# EAGLE schematic crtBias (EAGLE 7.5.0)
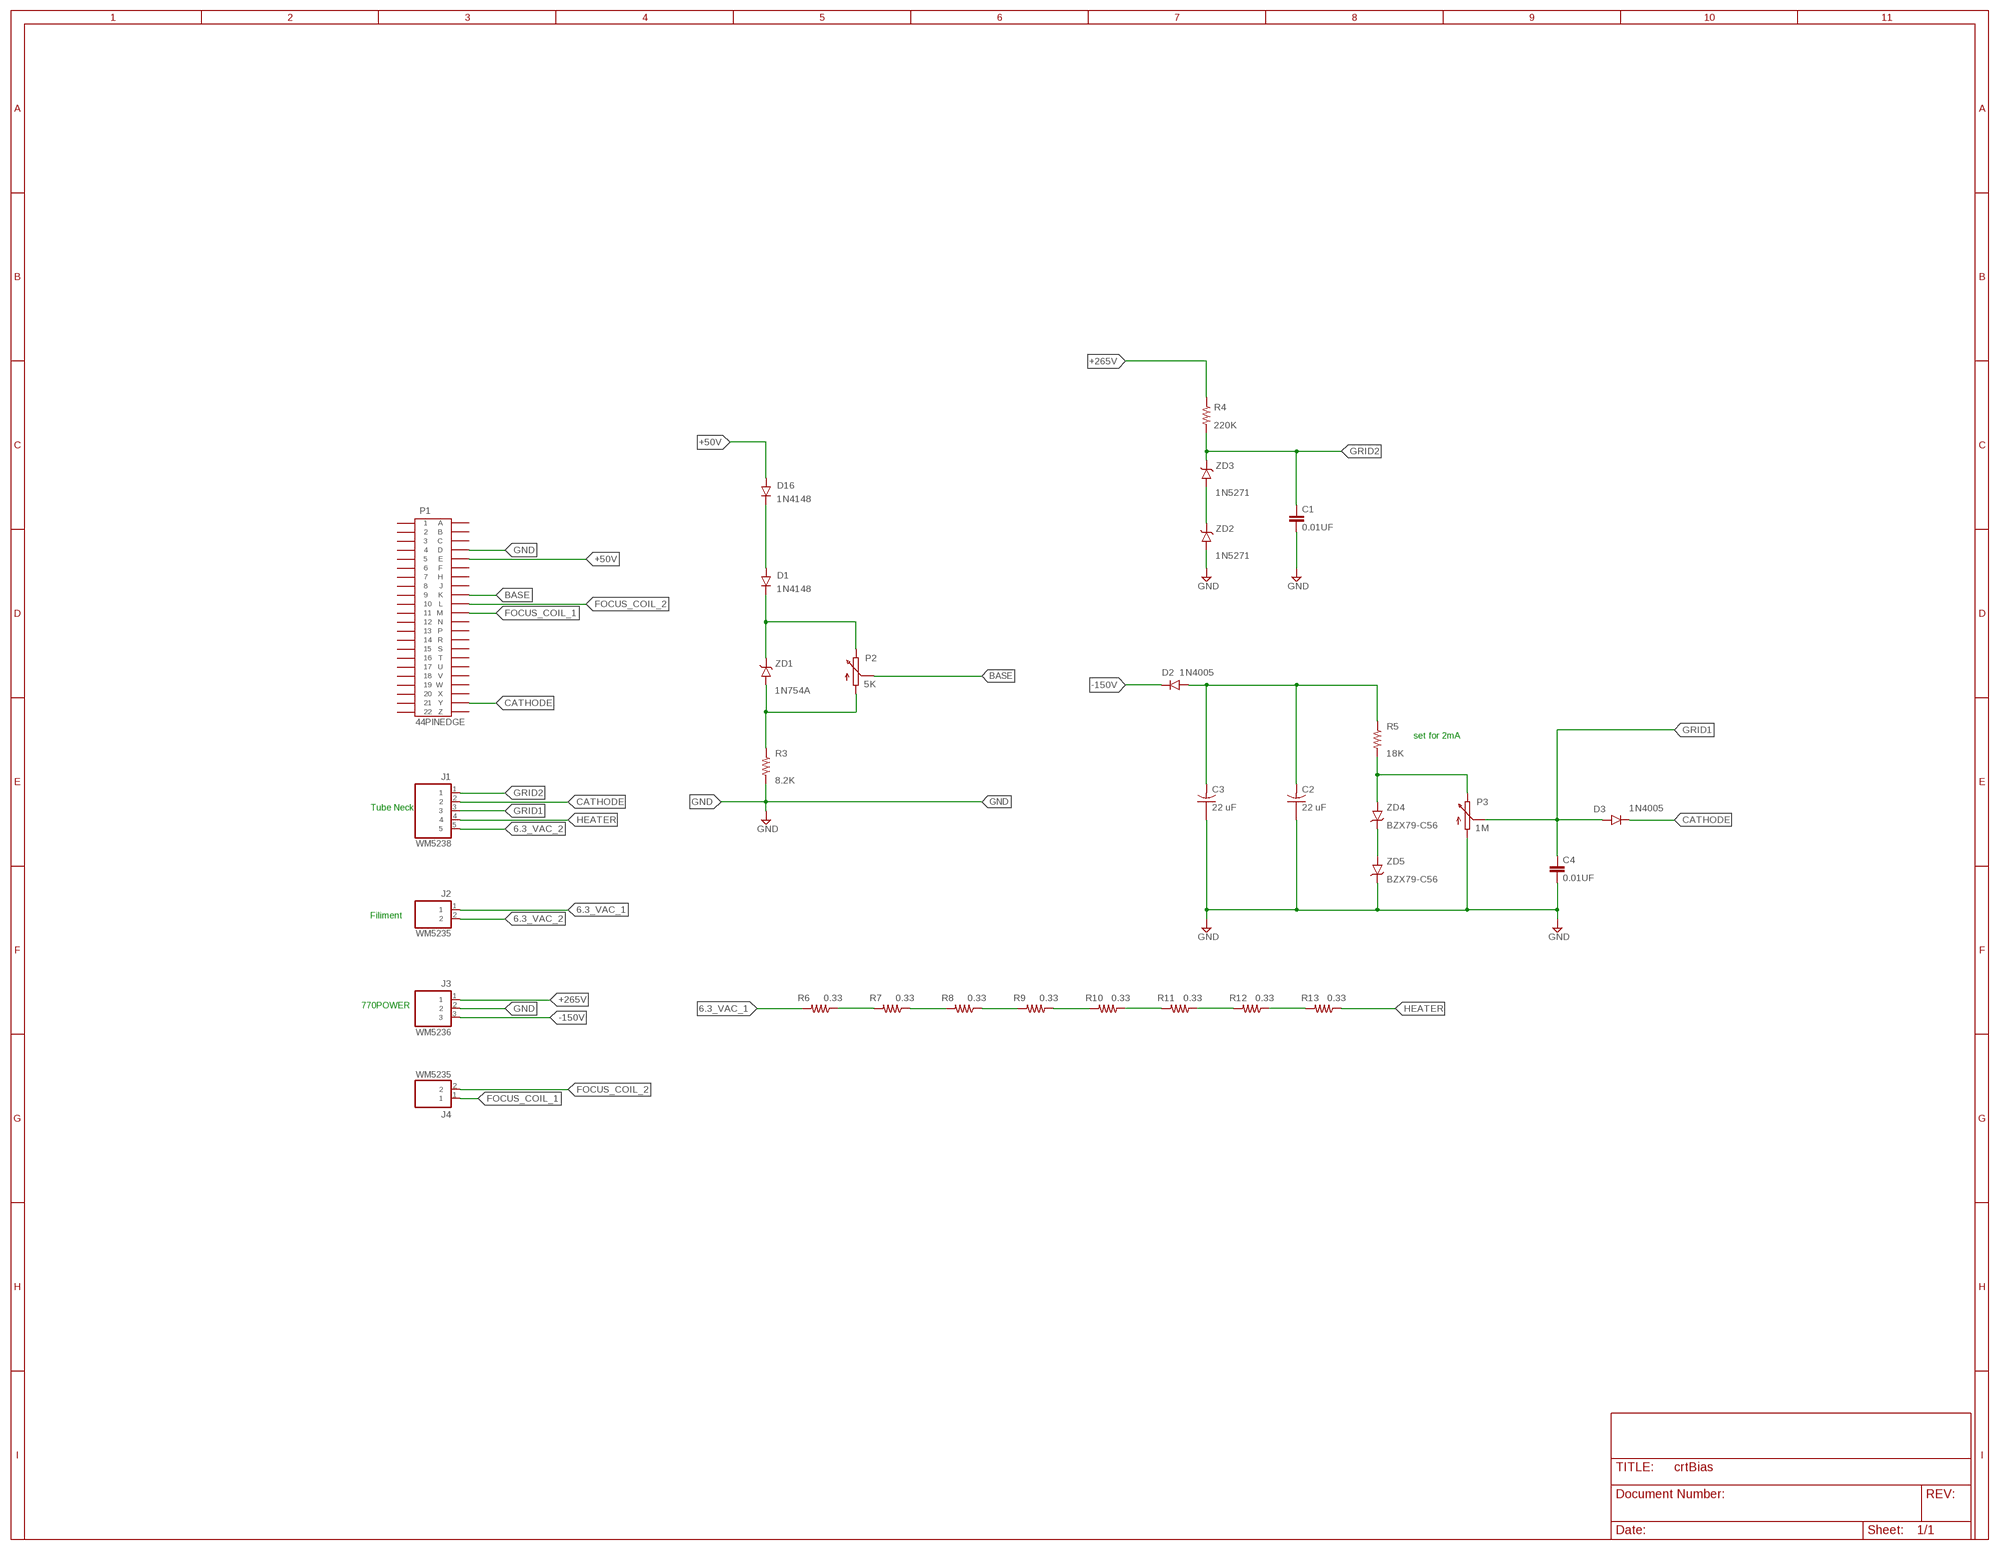
[diagram p0: schematic, sheet 1]

## Parts
C1  0.01UF  CAP_5MM  [5MM_TH]
C2  22 uF  CAP100UF200V  [AXIAL10X26]
C3  22 uF  CAP100UF200V  [AXIAL10X26]
C4  0.01UF  CAP_5MM  [5MM_TH]
D1  1N4148  [DO35-7]
D2  1N4005  1N400X  [DO-41-10]
D3  1N4005  1N400X  [DO-41-10]
D16  1N4148  [DO35-7]
J1  WM5238  [MOLEX-WM5238]
J2  WM5235  [MOLEX-WM5235]
J3  WM5236  [MOLEX-WM5236]
J4  WM5235  [MOLEX-WM5235]
P1  44PINEDGE  [44PINEDGE]
P2  5K  POT-3006P  [3006P]
P3  1M  POT-3006P  [3006P]
R3  8.2K  RES-V  [0207/10]
R4  220K  RES-V  [0207/10]
R5  18K  RES-V  [0207/10]
R6  0.33  R-1/2WATT  [0309/12]
R7  0.33  R-1/2WATT  [0309/12]
R8  0.33  R-1/2WATT  [0309/12]
R9  0.33  R-1/2WATT  [0309/12]
R10  0.33  R-1/2WATT  [0309/12]
R11  0.33  R-1/2WATT  [0309/12]
R12  0.33  R-1/2WATT  [0309/12]
R13  0.33  R-1/2WATT  [0309/12]
ZD1  1N754A  [DO35-7]
ZD2  1N5271  1N754A  [DO35-7]
ZD3  1N5271  1N754A  [DO35-7]
ZD4  BZX79-C56  1N754A  [DO35-7]
ZD5  BZX79-C56  1N754A  [DO35-7]

## Nets
6.3_VAC_1: J2.1 R6.2
6.3_VAC_2: J1.5 J2.2
+50V: D16.A P1.E
+265V: J3.1 R4.1
-150V: D2.C J3.3
BASE: P1.K P2.2(S)
CATHODE: D3.C J1.2 P1.Y
FOCUS_COIL_1: J4.1
FOCUS_COIL_2: J4.2 P1.L
GND: C1.2 C2.P$1 C3.P$1 C4.2 J3.2 P1.D P3.1(A) R3.2 ZD2.A ZD5.C
GRID1: C4.1 D3.A J1.3 P3.2(S)
GRID2: C1.1 J1.1 R4.2 ZD3.C
HEATER: J1.4 R13.1
N$1: ZD4.C ZD5.A
N$2: ZD2.C ZD3.A
N$3: D1.C P2.3(E) ZD1.C
N$4: D1.A D16.C
N$5: R6.1 R7.2
N$6: P2.1(A) R3.1 ZD1.A
N$7: P3.3(E) R5.2 ZD4.A
N$8: C2.P$2 C3.P$2 D2.A R5.1
N$9: R7.1 R8.2
N$10: R8.1 R9.2
N$11: R9.1 R10.2
N$12: R10.1 R11.2
N$13: R11.1 R12.2
N$14: R12.1 R13.2
Unconnected: P1.1 P1.2 P1.3 P1.4 P1.5 P1.6 P1.7 P1.8 P1.9 P1.10 P1.11 P1.12 P1.13 P1.14 P1.15 P1.16 P1.17 P1.18 P1.19 P1.20 P1.21 P1.22 P1.A P1.B P1.C P1.F P1.H P1.J P1.M P1.N P1.P P1.R P1.S P1.T P1.U P1.V P1.W P1.X P1.Z

## Notes on the sheet
- set for 2mA
- Tube Neck
- Filiment
- 770POWER

## Library data of the parts
C1 C4 = keiths:CAP_5MM: Through hole radial, 5m pin spacing.
C2 C3 = keiths:CAP100UF200V: Axial lead electrolytic cap. Illinois Capacitor 107TTA100M; PN: TVX2C220MCD
D1 D16 = keiths:1N4148: High Conductance Fast Diode
D2 D3 = keiths:1N400X: 1N4001 - 1N4007 general purpose rectifier
J1 = keiths:WM5238: 156 HEADER ASSEMBLY FRICTION LOCK RIGHT ANGLE 5 Position
J2 J4 = keiths:WM5235: 156 HEADER ASSEMBLY FRICTION LOCK RIGHT ANGLE 2 Position
J3 = keiths:WM5236: 156 HEADER ASSEMBLY FRICTION LOCK RIGHT ANGLE 3 Position
P1 = keiths:44PINEDGE: 44 PIN EDGE CONNECTOR FOR PCB
P2 P3 = keiths:POT-3006P: 3006 - Trimpot® Trimming Potentiometer. Clockwise turn moves wiper to pin 3; PN: 3006W-1-200LF
R3-R5 = keiths:RES-V: 1/4 watt through hole size
R6-R13 = keiths:R-1/2WATT: Half watt through hole resistor.
ZD1-ZD5 = keiths:1N754A: Zener diode 500mW, 5% TOLERANCE